# Altium schematic sheet Serial_Ports.SchDoc
size A4; SheetNumber: 1; SheetTotal: 12
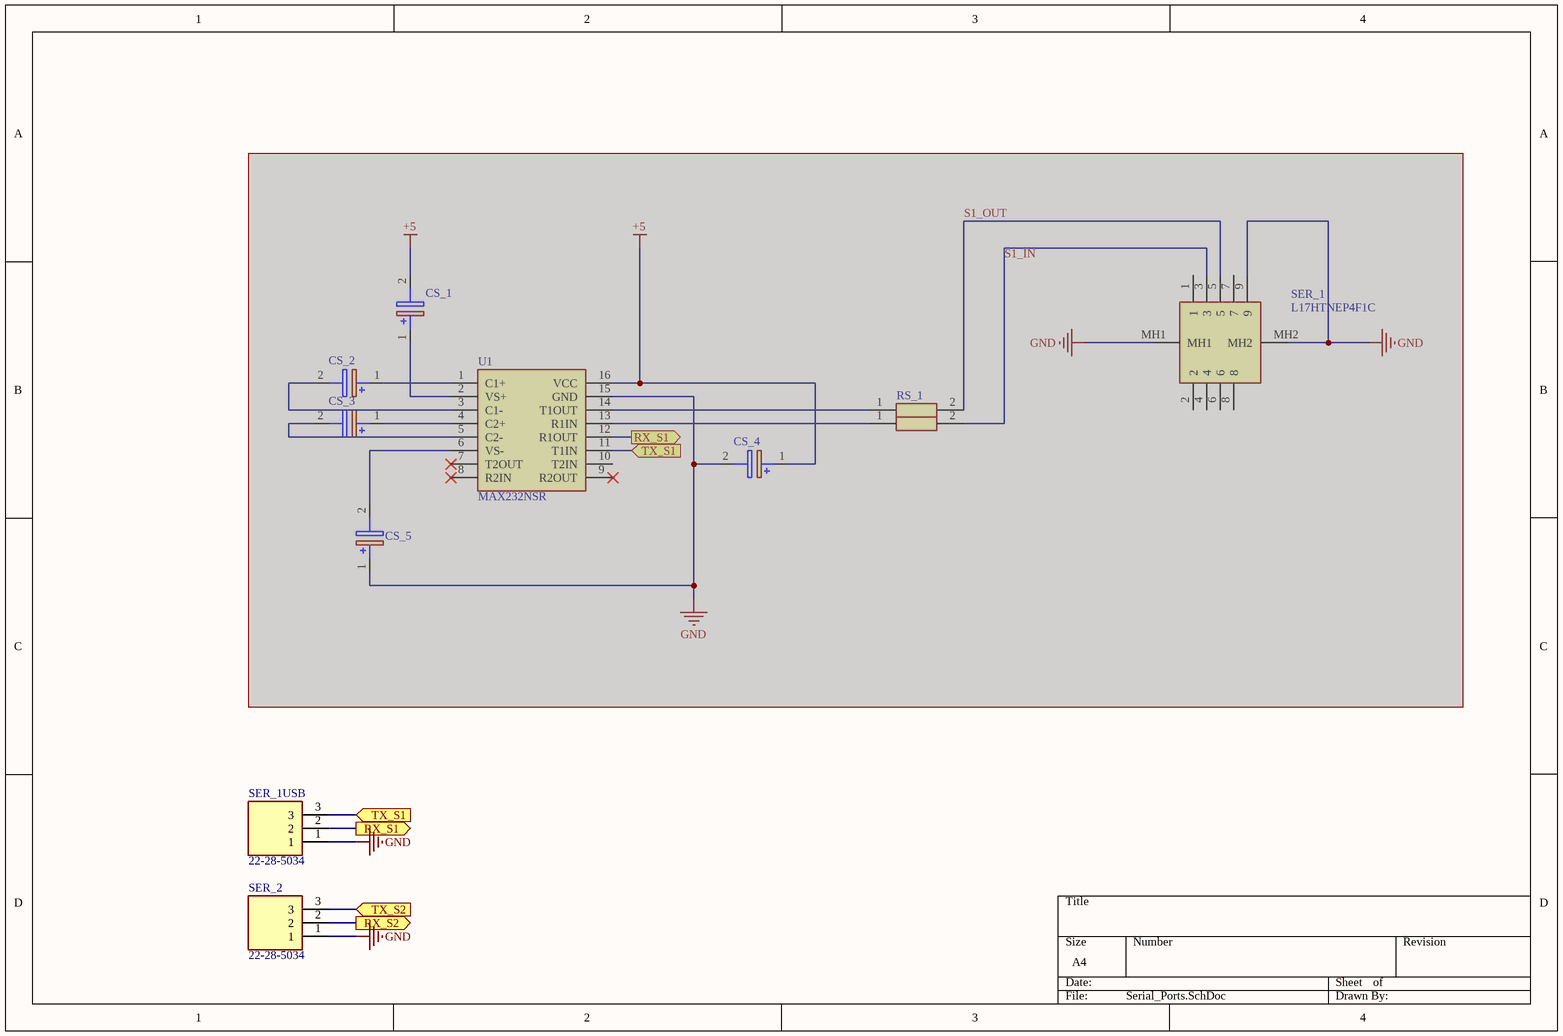
[diagram p0: Serial_Ports.SchDoc]

## Parts
CS_1  EDH105M050A9BAA  [CAPAE430X565N]  (value not drawn)  (masked out: inside a compile mask, not in the netlist)
CS_2  EDH105M050A9BAA  [CAPAE430X565N]  (value not drawn)  (masked out: inside a compile mask, not in the netlist)
CS_3  EDH105M050A9BAA  [CAPAE430X565N]  (value not drawn)  (masked out: inside a compile mask, not in the netlist)
CS_4  EDH105M050A9BAA  [CAPAE430X565N]  (value not drawn)  (masked out: inside a compile mask, not in the netlist)
CS_5  EDH105M050A9BAA  [CAPAE430X565N]  (value not drawn)  (masked out: inside a compile mask, not in the netlist)
RS_1  RCC0805100RFKEA  [RCC0805_e3]  (value not drawn)  (masked out: inside a compile mask, not in the netlist)
RS_2  RCC0805100RFKEA  [RCC0805_e3]  (value not drawn)  (masked out: inside a compile mask, not in the netlist)
SER_1  L17HTNEP4F1C  [L17HTNEP4F1C]  (masked out: inside a compile mask, not in the netlist)
SER_1USB  22-28-5034  [HDRV3W66P0X254_1X3_1016X249X1042P]
SER_2  22-28-5034  [HDRV3W66P0X254_1X3_1016X249X1042P]
U1  MAX232NSR  [SOIC127P780X200-16N]  (masked out: inside a compile mask, not in the netlist)

## Ports
RX_S1 (out), RX_S2 (out), TX_S1 (in), TX_S2 (in)

## Nets
GND: SER_1USB.1 SER_2.1
RX_S1: SER_1USB.2 ; port RX_S1
RX_S2: SER_2.2 ; port RX_S2
TX_S1: SER_1USB.3 ; port TX_S1
TX_S2: SER_2.3 ; port TX_S2

## Library data of the parts
CS_1-CS_5 = EDH105M050A9BAA: Capacitor Polarised; Manufacturer_Name: KEMET; Datasheet Link: https://content.kemet.com/datasheets/KEM_A4049_EDH.pdf; Height: 5.65mm; Manufacturer_Part_Number: EDH105M050A9BAA; Mouser Part Number: 80-EDH105M050A9BAA; Mouser Price/Stock: https://www.mouser.co.uk/ProductDetail/KEMET/EDH105M050A9BAA?qs=E9QF1UCAUX56DBSFGzxVeg%3D%3D; Arrow Part Number: EDH105M050A9BAA; Arrow Price/Stock: https://www.arrow.com/en/products/edh105m050a9baa/kemet-corporation?region=europe
RS_1 RS_2 = RCC0805100RFKEA: Resistor; Manufacturer_Name: Vishay; Datasheet Link: https://www.vishay.com/docs/20066/rcce3.pdf; Height: 0.5mm; Manufacturer_Part_Number: RCC0805100RFKEA; Mouser Part Number: 71-RCC0805100RFKEA; Mouser Price/Stock: https://www.mouser.co.uk/ProductDetail/Vishay-Dale/RCC0805100RFKEA?qs=GedFDFLaBXHpeG221Izd5g%3D%3D; Arrow Part Number: RCC0805100RFKEA; Arrow Price/Stock: https://www.arrow.com/en/products/rcc0805100rfkea/vishay?region=nac
SER_1 = L17HTNEP4F1C: Connector; Manufacturer_Name: Amphenol Communications Solutions; Datasheet Link: https://cdn.amphenol-cs.com/media/wysiwyg/files/drawing/l17htnxp4fxc.pdf; Height: 12.55mm; Manufacturer_Part_Number: L17HTNEP4F1C; Mouser Part Number: 523-L17HTNEP4F1C; Mouser Price/Stock: https://www.mouser.co.uk/ProductDetail/Amphenol-Commercial-Products/L17HTNEP4F1C?qs=U9AFyCBc0MwQlSlNY0N8tQ%3D%3D
SER_1USB SER_2 = 22-28-5034: Connector; Manufacturer_Name: Molex; Datasheet Link: https://componentsearchengine.com/Datasheets/2/22-28-5034.pdf; Height: 10.42mm; Manufacturer_Part_Number: 22-28-5034; Mouser Part Number: 538-22-28-5034; Mouser Price/Stock: https://www.mouser.co.uk/ProductDetail/Molex/22-28-5034?qs=l%252BWx29wYPrxAp9jaws3tbA%3D%3D
U1 = MAX232NSR: Integrated Circuit; Manufacturer_Name: Texas Instruments; Datasheet Link: http://www.ti.com/general/docs/lit/getliterature.tsp?genericPartNumber=MAX232&fileType=pdf&HQS=ti-null-null-sf-df-pf-sep-wwe&DCM=yes; Height: 2mm; Manufacturer_Part_Number: MAX232NSR; Mouser Part Number: 595-MAX232NSR; Mouser Price/Stock: https://www.mouser.co.uk/ProductDetail/Texas-Instruments/MAX232NSR?qs=paYhMW8qfiuOrkdV8Ubirw%3D%3D; Arrow Part Number: MAX232NSR; Arrow Price/Stock: https://www.arrow.com/en/products/max232nsr/texas-instruments?region=nac